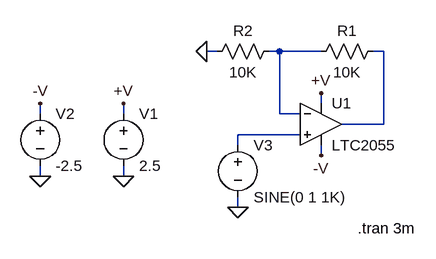
[diagram p0: schematic 2055.asc]
2055.asc, the LTspice schematic file:
Version 4
SHEET 1 896 680
WIRE -128 16 -144 16
WIRE -32 16 -48 16
WIRE 32 16 -32 16
WIRE 128 16 112 16
WIRE 32 96 32 80
WIRE -400 112 -400 96
WIRE -272 112 -272 96
WIRE -32 112 -32 16
WIRE 0 112 -32 112
WIRE 128 128 128 16
WIRE 128 128 64 128
WIRE 0 144 -96 144
WIRE -96 160 -96 144
WIRE 32 176 32 160
WIRE -400 208 -400 192
WIRE -272 208 -272 192
WIRE -96 256 -96 240
FLAG -272 208 0
FLAG 32 80 +V
FLAG -272 96 +V
FLAG 32 176 -V
FLAG -400 208 0
FLAG -400 96 -V
FLAG -96 256 0
FLAG -144 16 0
SYMBOL voltage -272 96 R0
SYMATTR InstName V1
SYMATTR Value 2.5
SYMBOL voltage -400 96 R0
SYMATTR InstName V2
SYMATTR Value -2.5
SYMBOL voltage -96 144 R0
SYMATTR InstName V3
SYMATTR Value SINE(0 1 1K)
SYMBOL res 128 0 R90
WINDOW 0 0 56 VBottom 2
WINDOW 3 32 56 VTop 2
SYMATTR InstName R1
SYMATTR Value 10K
SYMBOL res -32 0 R90
WINDOW 0 0 56 VBottom 2
WINDOW 3 32 56 VTop 2
SYMATTR InstName R2
SYMATTR Value 10K
SYMBOL opamps\\LTC2055 32 128 R0
SYMATTR InstName U1
TEXT 88 288 Left 2 !.tran 3m

The netlist it stands for:
* 2055.asc
V1 +V 0 2.5
V2 -V 0 -2.5
V3 N003 0 SINE(0 1 1K)
R1 N002 N001 10K
R2 N001 0 10K
XU1 N003 N001 N002 +V -V LTC2054  ; LTC2055, pins In+ In- OUT V+ V-
.tran 3m
.lib LTC2.lib
.backanno
.end